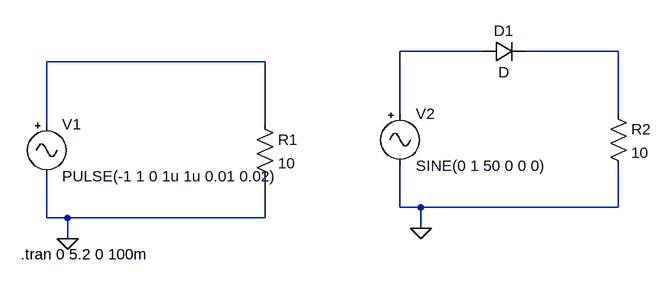
[diagram p0: schematic Faurier_Test.asc]
Faurier_Test.asc, the LTspice schematic file:
Version 4.1
SHEET 1 1064 680
WIRE 800 32 672 32
WIRE 1008 32 864 32
WIRE 464 48 128 48
WIRE 672 128 672 32
WIRE 1008 128 1008 32
WIRE 128 144 128 48
WIRE 464 144 464 48
WIRE 672 272 672 208
WIRE 704 272 672 272
WIRE 1008 272 1008 208
WIRE 1008 272 704 272
WIRE 128 288 128 224
WIRE 160 288 128 288
WIRE 464 288 464 224
WIRE 464 288 160 288
WIRE 704 304 704 272
WIRE 160 320 160 288
FLAG 160 320 0
FLAG 704 304 0
SYMBOL Misc\\signal 128 128 R0
WINDOW 123 0 0 Left 0
WINDOW 39 0 0 Left 0
SYMATTR InstName V1
SYMATTR Value PULSE(-1 1 0 1u 1u 0.01 0.02)
SYMBOL res 448 128 R0
SYMATTR InstName R1
SYMATTR Value 10
SYMBOL Misc\\signal 672 112 R0
WINDOW 123 0 0 Left 0
WINDOW 39 0 0 Left 0
SYMATTR InstName V2
SYMATTR Value SINE(0 1 50 0 0 0)
SYMBOL res 992 112 R0
SYMATTR InstName R2
SYMATTR Value 10
SYMBOL diode 800 48 R270
WINDOW 0 32 32 VTop 2
WINDOW 3 0 32 VBottom 2
SYMATTR InstName D1
TEXT 88 344 Left 2 !.tran 0 5.2 0 100m

The netlist it stands for:
* Faurier_Test.asc
V1 N003 0 PULSE(-1 1 0 1u 1u 0.01 0.02)
R1 N003 0 10
V2 N001 0 SINE(0 1 50 0 0 0)
R2 N002 0 10
D1 N001 N002 D
.model D D
.lib standard.dio
.tran 0 5.2 0 100m
.backanno
.end